# EAGLE design KE3IJ-SuperRegen-FM-receiver (EAGLE 5.07)
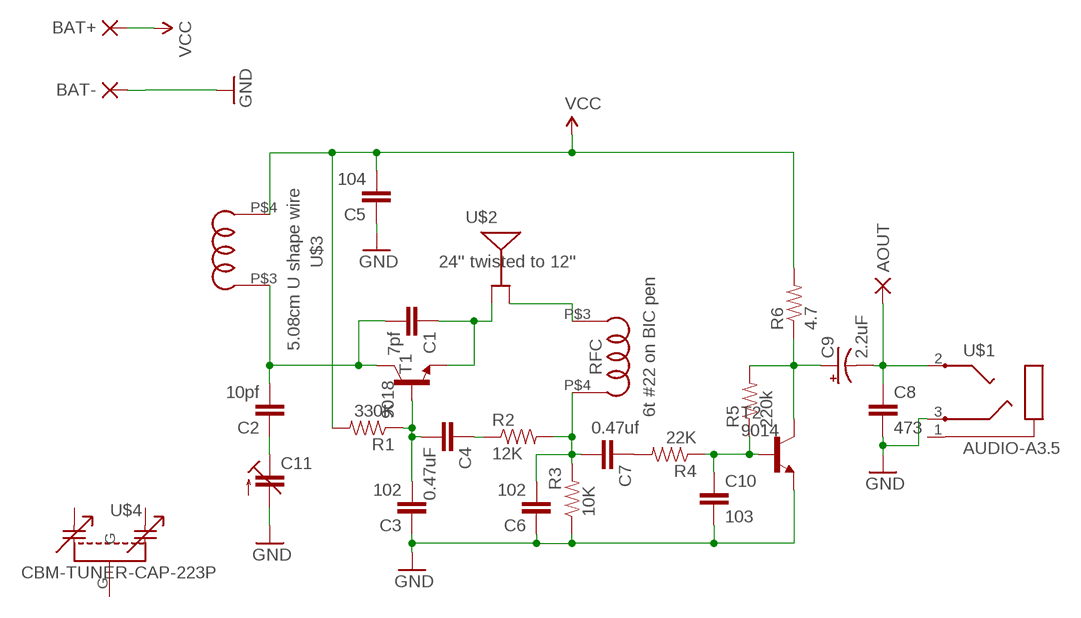
[diagram p0: schematic, sheet 1]

## Parts
AOUT  PAD-SMD20S  [SMD20S]
BAT+  PAD-SMD20S  [SMD20S]
BAT-  PAD-SMD20S  [SMD20S]
C1  7pf  CAP-RF  [CAP-SMD-SMALL]
C2  10pf  CAP-RF  [CAP-SMD-SMALL]
C3  102  CAPPTH1  [CAP-PTH-5MM]
C4  0.47uF  CAP0805  [0805]
C5  104  CAPPTH1  [CAP-PTH-5MM]
C6  102  CAPPTH  [CAP-PTH-SMALL]
C7  0.47uf  CAP0805  [0805]
C8  473  CAP0805  [0805]
C9  2.2uF  CAP_POL-RF  [CPOL-SMD-10UF-25V]
C10  103  CAPPTH  [CAP-PTH-SMALL]
C11  C-TRIMM3050.506  [CTRIM3050.506]
R1  330K  RESISTOR1/4W-RF  [AXIAL-0.3-SMD]
R2  12K  RESISTOR0805  [0805]
R3  10K  RESISTOR1/4W  [AXIAL-0.3]
R4  22K  RESISTOR0805  [0805]
R5  220k  RESISTOR1/4W-RF  [AXIAL-0.3-SMD]
R6  4.7  RESISTOR1/4W-RF  [AXIAL-0.3-SMD]
RFC  6t #22 on BIC pen  AIR_COIL-HELICAL  [2CM-HELICAL]
T1  9018  -NPN-TO92-EBC-SMD-MIRROR  [TO92-EBC-SMD-MIRROR]
T2  9014  -NPN-TO92-EBC-SMD-MIRROR  [TO92-EBC-SMD-MIRROR]
U$1  AUDIO-A3.5  AUDIO-JACK-MINI-A3.5  [MIN-AUDIO-3.5MM]
U$2  24'' twisted to 12''  ANT-TWIST  [ANT-WISP-2PAD]
U$3  5.08cm U shape wire  AIR_COIL-U  [2.54CM-U-COIL]
U$4  CBM-TUNER-CAP-223P  [CBM-CAP]

## Nets
GND: C3.1 C5.1 C6.1 C8.2 C10.2 C11.2(A) R3.P$1 T2.E U$1.3(RING)
N$1: C1.P$2 C2.P$2 T1.C U$3.P$3
N$2: C10.1 R4.1 R5.P$1 T2.B
N$3: C1.P$1 T1.E U$2.P$3(S2)
N$4: C3.2 C4.2 R1.P$1 T1.B
N$5: C4.1 R2.1
N$6: C6.2 C7.2 R2.2 R3.P$2 RFC.P$4
N$7: C7.1 R4.2
N$8: AOUT.PAD(P) C8.1 C9.- U$1.2(TIP)
N$9: C9.+ R5.P$2 R6.P$1 T2.C
N$10: RFC.P$3 U$2.P$4(S1)
N$11: C2.P$1 C11.1A(E)
N$12: BAT-.PAD(P)
VCC: BAT+.PAD(P) C5.2 R1.P$2 R6.P$2 U$3.P$4
Unconnected: U$1.1(EARTH) U$4.A U$4.G U$4.O

## Library data of the parts
AOUT BAT+ BAT- = dpads:PAD: WIRE PAD Standard US Drill Sizes and SMD pads
C1-C3 C5 C6 = digital-toy:CAP: Capacitor Standard 0603 ceramic capacitor, and 0.1" leaded capacitor.
C4 C7 C8 C10 = SparkFun:CAP: Capacitor Standard 0603 ceramic capacitor, and 0.1" leaded capacitor.
C9 = digital-toy:CAP_POL: Capacitor Polarized These are standard SMD and PTH capacitors. Normally 10uF, 47uF, and 100uF in electrolytic and tantalum varieties. Always verify the external diameter of the through hole cap, it varies with capacity, voltage, and manufacturer. The EIA devices should be standard. PANASONIC_D size: 6.5mmx6.5mmx5.5mm, 100uf (taobao:6.3mmx5.5mm), same as CVL0605 153cvl0405 size: 4mmx4mmx5.5mm, 10uf (taobao:4mmx5.5mm)
C11 = resistor:C-TRIMM: Trimm capacitor
R1-R6 = digital-toy:RESISTOR: Resistor Basic schematic elements and footprints for 0603, 1206, and PTH 1/10th watt (small) resistors. digital-toy copy vertical mount of axial-0.3 from rcl.lbr : the 0207/xx
RFC U$3 = digital-toy:AIR_COIL
T1 T2 = digital-toy:*-NPN-: NPN Transistror most of sot-23 use the pacages sot23-BEC, top C, left B, right E. by hyl, digital-toy. and to-92 use ebc(from-top) by hyl, digital-toy.
U$1 = digital-toy:AUDIO-JACK: 2.5 Stereo Audio Jack (SMT)
U$2 = digital-toy:ANT-TWIST
U$4 = digital-toy:CBM-TUNER-CAP

## Board
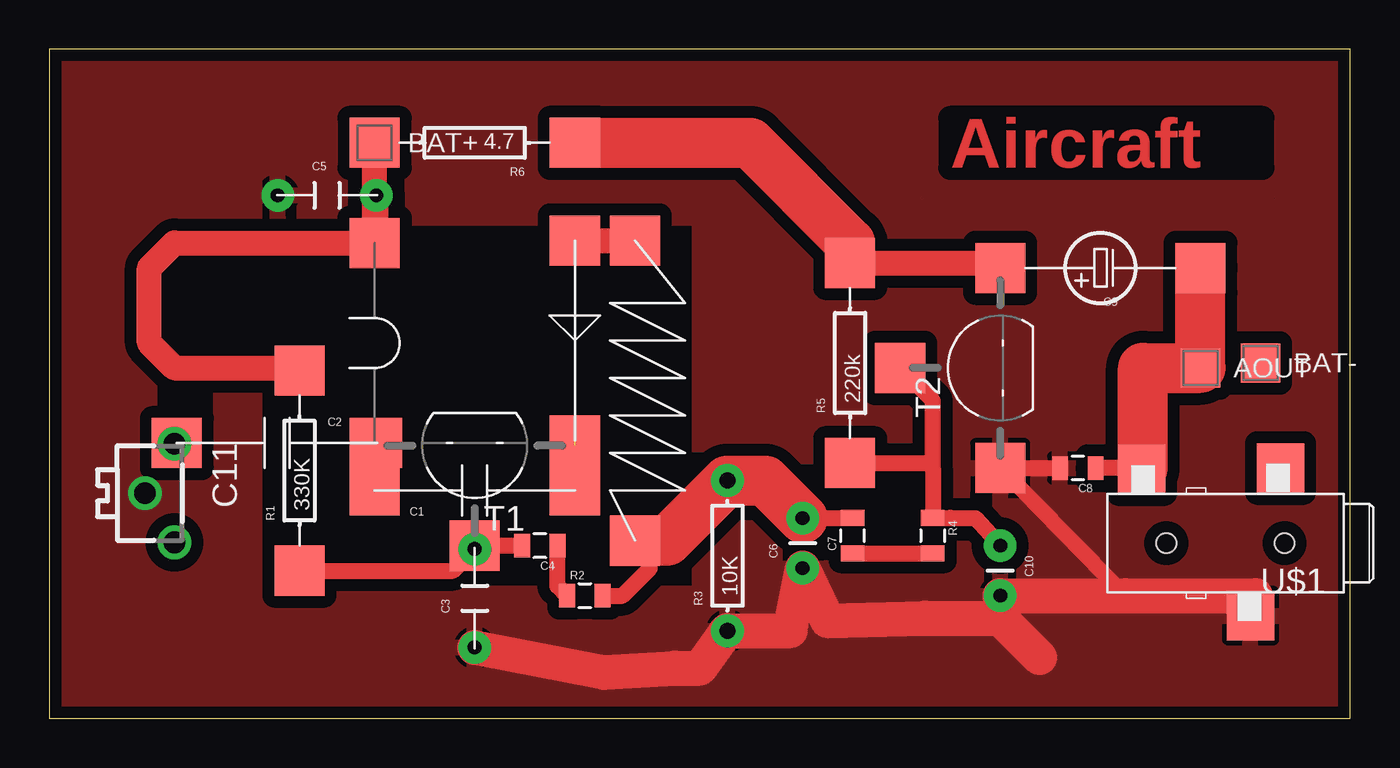
[diagram p1: board, top side]

Size 66.02 x 33.96 mm. Coordinates in mm from the lower left corner, seen from the top.
Outline: 0,0 66.02,0 66.02,33.96 0,33.96 0,0
Copper layers (1*16): Top 0.035mm / dielectric 1.5mm / Bottom 0.035mm
Design rules "SparkFun-RF": minimum track width 8mil, minimum drill 20mil, track to track 8mil, track to pad 8mil, pad to pad 8mil, via to via 8mil, smd to smd 0mil, copper to edge 10mil, drill to drill 8mil, minimum pad ring 12mil, minimum via ring 10mil, stop-mask expansion 4mil, vias tented up to drill 25mil, thermal gap 10mil

### Footprints (pad centres in the part's own frame; a part is rotated, then mirrored left to right if it is on the bottom)
SMD20S = smd 2 x 2: PAD 0,0
CAP-SMD-SMALL = smd 2.54 x 2.54: P$1 5.08,0; P$2 -5.08,0
CAP-PTH-5MM = drill 0.7 pad 1.651 round: 1 -2.5,0; 2 2.5,0
0805 = smd 0.8 x 1.2: 1 -0.9,0; 2 0.9,0
CAP-PTH-SMALL = drill 0.7 pad 1.651 round: 1 0,0; 2 2.54,0
CPOL-SMD-10UF-25V = smd 2.54 x 2.54: + 5.08,0; - -5.08,0
CTRIM3050.506 = drill 1.1 round: 1A -2.5,1.27; 1B 2.5,1.27; 2 0,-0.23
AXIAL-0.3-SMD = smd 2.54 x 2.54: P$1 -5.08,0; P$2 5.08,0
AXIAL-0.3 = drill 0.813 pad 1.676 round: P$1 -3.81,0; P$2 3.81,0
2CM-HELICAL = smd 2.54 x 2.54: P$3 -7.62,0; P$4 7.62,0
TO92-EBC-SMD-MIRROR = smd 2.54 x 2.54: B 0,5.08; C 5.08,0; E -5.08,0
MIN-AUDIO-3.5MM = smd 2.4 x 2.5: 1 -2.794,-3.81; 2 4.257,-3.754; 3 -1.27,3.683 | hole 1: -3,0; 3,0
ANT-WISP-2PAD = smd 2.54 x 2.54: P$3 -5.08,0; P$4 5.08,0
2.54CM-U-COIL = smd 2.54 x 2.54: P$3 -5.08,0; P$4 5.08,0
CBM-CAP = smd 1.93 x 3.81: A 7.3,-12.7; G 0,-12.7; O -7.3,-12.7 | hole 4.1: 0,0 | hole 2.7: -7,0; 7,0

### Placement (x,y rotation side)
AOUT  58.42,17.78 0 top
BAT+  16.51,29.21 0 top
BAT-  61.47,18.03 0 top
C1  21.59,11.56 0 top
C2  11.56,13.97 180 top
C3  21.59,6.1 90 top
C4  24.89,8.76 180 top
C5  14.1,26.54 0 top
C6  38.23,7.62 90 top
C7  40.77,9.27 90 top
C8  52.2,12.7 180 top
C9  53.34,22.86 180 top
C10  48.26,8.76 270 top
C11  5.08,11.43 270 top
R1  12.7,12.57 90 top
R2  27.18,6.22 0 top
R3  34.42,8.26 90 top
R4  44.83,9.27 270 top
R5  40.64,18.03 90 top
R6  21.59,29.21 180 top
RFC  29.72,16.64 270 top
T1  21.59,13.84 180 top
T2  48.26,17.78 90 top
U$1  59.69,8.89 180 top
U$2  26.67,19.18 90 top
U$3  16.51,19.05 90 top
U$4  33.4,47.12 180 top  (outside the outline)

### Tracks (layer width: path | path; a pad name or v marks a point on that pad's centre or on a via)
GND
  Top 0.813: 54.61,6.22 T2.E C8.2
  Top 1.778: C3.1 28.15,2.33 31.75,2.54 33.02,2.54 34.29,4.32 R3.P$1 37.59,4.45 C6.1 39.5,4.95 44.45,5.08 48.26,5.08 | 48.26,5.08 48.39,5.08 C10.2 54.61,6.22 61.21,6.22 U$1.3 | 48.26,5.08 50.26,3.08
  pour Top (isolate 0.61, hatched): 77.47,41.91 77.47,-6.35 -6.35,-5.08 -6.35,8.89 0,15.24 7.62,15.24 8.89,13.97 8.89,7.62 10.16,6.35 33.02,6.35 33.02,25.4 -6.35,25.4 -6.35,41.91
  pour Top (isolate 0.61, no thermals): -5.08,44.45 6.35,44.45 10.16,40.64 10.16,-6.35 6.35,-10.16 -7.62,-10.16 -12.7,-5.08 -12.7,36.83
N$1
  Top 0.813: U$3.P$3 C2.P$2
  Top 1.778: T1.C U$3.P$3
  Top 2.54: C1.P$2 T1.C
N$2
  Top 0.813: 44.83,12.7 R4.1 45.71,10.17 46.99,10.16 C10.1 | 44.83,12.7 44.83,16.13 T2.B | R5.P$1 44.58,12.95 44.83,12.7
N$3  (1 unrouted)
  Top 2.54: C1.P$1 T1.E
N$4
  Top 0.813: R1.P$1 20.49,7.49 C3.2 T1.B C4.2
N$5
  Top 0.813: C4.1 25.79,6.71 R2.1
N$6
  Top 0.813: C6.2 40.76,10.16 C7.2 | R2.2 29.08,6.22 30.48,7.62 30.48,9.02
  Top 2.54: C6.2 36.32,12.06 R3.P$2 31.37,9.02 30.48,9.02 RFC.P$4
N$7
  Top 0.813: C7.1 R4.2
N$8
  Top 0.813: C8.1 55.38,12.7 U$1.2 55.49,12.7
  Top 2.54: 55.49,12.7 55.5,17.78 AOUT.PAD C9.-
N$9
  Top 1.27: R5.P$2 48.01,23.11
  Top 1.778: 40.64,24.13 R5.P$2 | 48.01,23.11 C9.+
  Top 2.54: R6.P$1 35.56,29.21 40.64,24.13
N$10
  Top 1.27: U$2.P$4 RFC.P$3
N$11  (1 unrouted)
VCC
  Top 1.27: U$3.P$4 BAT+.PAD | U$3.P$4 6.35,24.13 5.08,22.86 5.08,19.05 6.35,17.78 12.57,17.78 R1.P$2 12.7,17.78 | C5.2 16.6,24.22 U$3.P$4

### Text on the board
Top: Aircraft